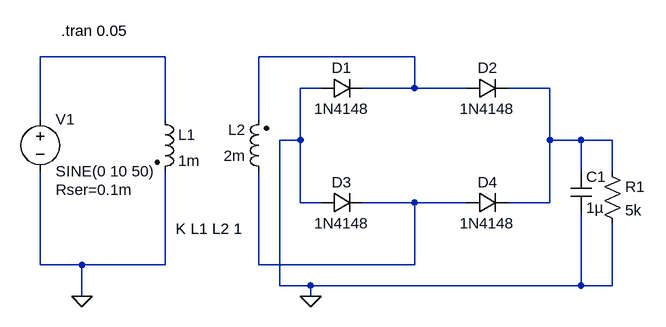
[diagram p0: schematic Ex-10.asc]
Ex-10.asc, the LTspice schematic file:
Version 4
SHEET 1 880 680
WIRE 48 48 -144 48
WIRE 432 48 192 48
WIRE 288 96 256 96
WIRE 432 96 432 48
WIRE 432 96 352 96
WIRE 512 96 432 96
WIRE 640 96 576 96
WIRE -144 144 -144 48
WIRE 48 144 48 48
WIRE 192 144 192 48
WIRE 256 176 256 96
WIRE 256 176 224 176
WIRE 640 176 640 96
WIRE 688 176 640 176
WIRE 736 176 688 176
WIRE 688 224 688 176
WIRE 736 224 736 176
WIRE 256 272 256 176
WIRE 288 272 256 272
WIRE 432 272 352 272
WIRE 512 272 432 272
WIRE 640 272 640 176
WIRE 640 272 576 272
WIRE -144 368 -144 224
WIRE -80 368 -144 368
WIRE 48 368 48 224
WIRE 48 368 -80 368
WIRE 192 368 192 224
WIRE 432 368 432 272
WIRE 432 368 192 368
WIRE 224 400 224 176
WIRE 272 400 224 400
WIRE 688 400 688 288
WIRE 688 400 272 400
WIRE 736 400 736 304
WIRE 736 400 688 400
WIRE -80 416 -80 368
WIRE 272 416 272 400
FLAG 272 416 0
FLAG -80 416 0
SYMBOL voltage -144 128 R0
WINDOW 123 0 0 Left 0
WINDOW 39 24 124 Left 2
SYMATTR InstName V1
SYMATTR Value SINE(0 10 50)
SYMATTR SpiceLine Rser=0.1m
SYMBOL ind2 32 128 R0
SYMATTR InstName L1
SYMATTR Value 1m
SYMATTR Type ind
SYMBOL ind2 208 240 R180
WINDOW 0 36 80 Left 2
WINDOW 3 36 40 Left 2
SYMATTR InstName L2
SYMATTR Value 2m
SYMATTR Type ind
SYMBOL diode 288 112 R270
WINDOW 0 32 32 VTop 2
WINDOW 3 0 32 VBottom 2
SYMATTR InstName D1
SYMATTR Value 1N4148
SYMBOL diode 512 112 R270
WINDOW 0 32 32 VTop 2
WINDOW 3 0 32 VBottom 2
SYMATTR InstName D2
SYMATTR Value 1N4148
SYMBOL diode 288 288 R270
WINDOW 0 32 32 VTop 2
WINDOW 3 0 32 VBottom 2
SYMATTR InstName D3
SYMATTR Value 1N4148
SYMBOL diode 512 288 R270
WINDOW 0 32 32 VTop 2
WINDOW 3 0 32 VBottom 2
SYMATTR InstName D4
SYMATTR Value 1N4148
SYMBOL res 720 208 R0
SYMATTR InstName R1
SYMATTR Value 5k
SYMBOL cap 672 224 R0
SYMATTR InstName C1
SYMATTR Value 1µ
TEXT -112 8 Left 2 !.tran 0.05
TEXT 64 312 Left 2 !K L1 L2 1

The netlist it stands for:
* Ex-10.asc
V1 N001 0 SINE(0 10 50) Rser=0.1m
L1 N001 0 1m
L2 N004 N002 2m
D1 0 N002 1N4148
D2 N002 N003 1N4148
D3 0 N004 1N4148
D4 N004 N003 1N4148
R1 N003 0 5k
C1 N003 0 1µ
.model D D
.lib standard.dio
.tran 0.05
K L1 L2 1
.backanno
.end